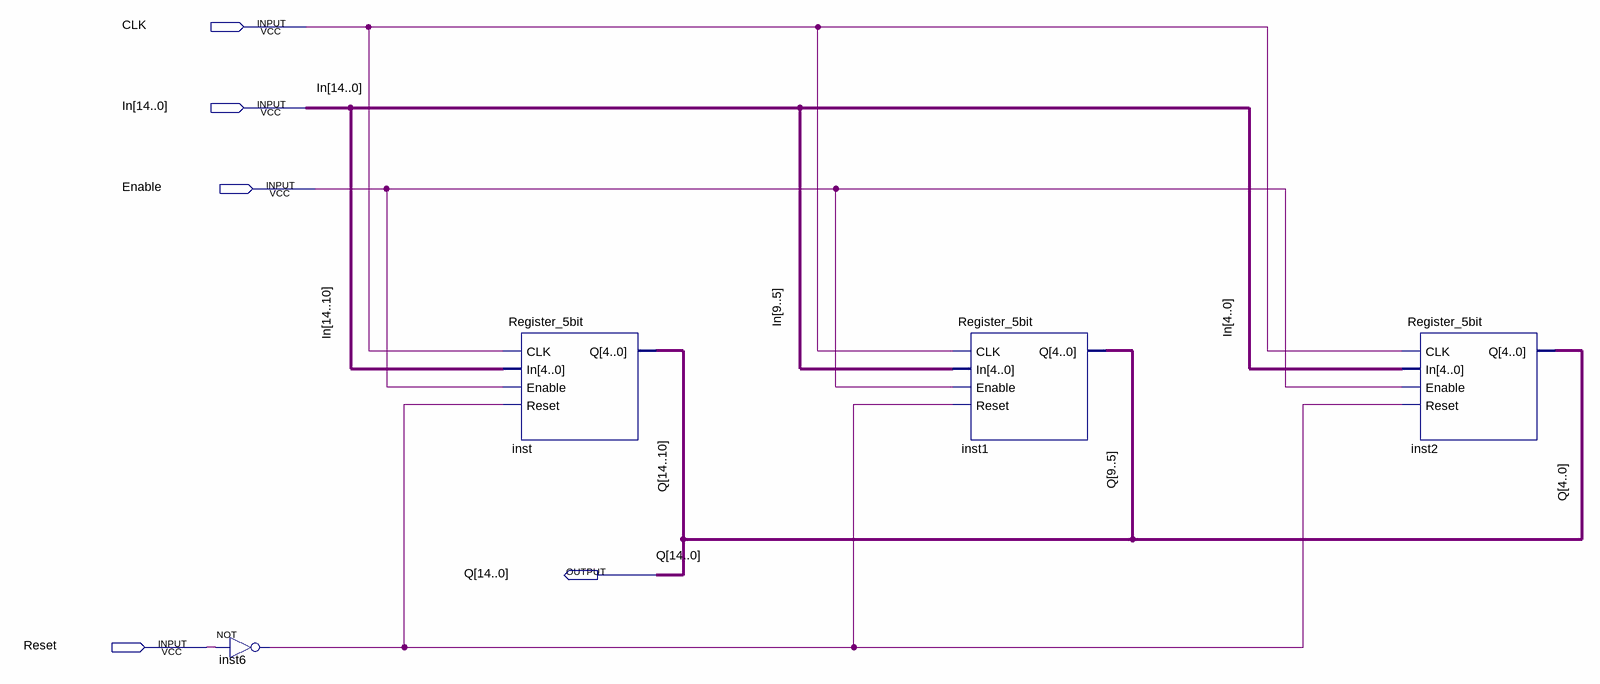
[diagram p0: schematic sheet]
// Quartus schematic Register_15bit.bdf as structural Verilog: 4 symbols, 5 pins
module Register_15bit (
  input  CLK,
  input  [14:0] In,
  input  Enable,
  input  Reset,
  output [14:0] Q
);

  wire inst6_out;

  not inst6 (inst6_out, Reset);
  Register_5bit inst (.CLK(CLK), .In(In[14:10]), .Enable(Enable), .Reset(inst6_out), .Q(Q[14:10]));
  Register_5bit inst1 (.CLK(CLK), .In(In[9:5]), .Enable(Enable), .Reset(inst6_out), .Q(Q[9:5]));
  Register_5bit inst2 (.CLK(CLK), .In(In[4:0]), .Enable(Enable), .Reset(inst6_out), .Q(Q[4:0]));
endmodule
